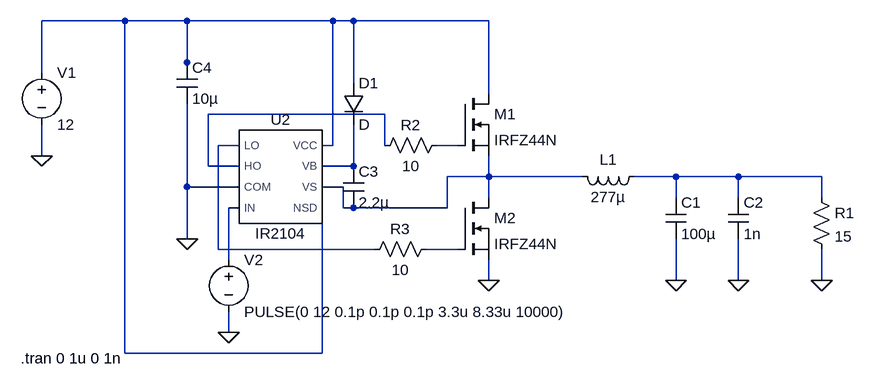
[diagram p0: schematic buck_driver.asc]
buck_driver.asc, the LTspice schematic file:
Version 4.1
SHEET 1 880 680
WIRE -480 -80 -608 -80
WIRE -384 -80 -480 -80
WIRE -160 -80 -384 -80
WIRE -128 -80 -160 -80
WIRE 80 -80 -128 -80
WIRE -384 -16 -384 -80
WIRE -608 0 -608 -80
WIRE -384 0 -384 -16
WIRE -128 16 -128 -80
WIRE 80 32 80 -80
WIRE -80 64 -352 64
WIRE -304 112 -336 112
WIRE -160 112 -160 -80
WIRE -160 112 -176 112
WIRE -80 112 -80 64
WIRE 32 112 0 112
WIRE -608 128 -608 80
WIRE -352 144 -352 64
WIRE -304 144 -352 144
WIRE -128 144 -128 80
WIRE -128 144 -176 144
WIRE 80 160 80 128
WIRE 80 160 16 160
WIRE 224 160 80 160
WIRE 368 160 304 160
WIRE 464 160 368 160
WIRE 592 160 464 160
WIRE -384 176 -384 48
WIRE -304 176 -384 176
WIRE -144 176 -176 176
WIRE 80 192 80 160
WIRE 368 192 368 160
WIRE 464 192 464 160
WIRE 592 192 592 160
WIRE -304 208 -320 208
WIRE -144 208 -144 176
WIRE -128 208 -144 208
WIRE 16 208 16 160
WIRE 16 208 -128 208
WIRE -384 256 -384 176
WIRE -336 272 -336 112
WIRE -96 272 -336 272
WIRE 32 272 -16 272
WIRE -320 288 -320 208
WIRE 80 320 80 288
WIRE 368 320 368 256
WIRE 464 320 464 256
WIRE 592 320 592 272
WIRE -320 400 -320 368
WIRE -480 432 -480 -80
WIRE -176 432 -176 208
WIRE -176 432 -480 432
FLAG 80 320 0
FLAG 368 320 0
FLAG 464 320 0
FLAG 592 320 0
FLAG -608 128 0
FLAG -384 256 0
FLAG -320 400 0
SYMBOL nmos 32 32 R0
SYMATTR InstName M1
SYMATTR Value IRFZ44N
SYMBOL ind 320 144 R90
WINDOW 0 5 56 VBottom 2
WINDOW 3 32 56 VTop 2
SYMATTR InstName L1
SYMATTR Value 277µ
SYMBOL nmos 32 192 R0
SYMATTR InstName M2
SYMATTR Value IRFZ44N
SYMBOL cap 352 192 R0
SYMATTR InstName C1
SYMATTR Value 100µ
SYMBOL cap 448 192 R0
SYMATTR InstName C2
SYMATTR Value 1n
SYMBOL res 576 176 R0
SYMATTR InstName R1
SYMATTR Value 15
SYMBOL voltage -608 -16 R0
WINDOW 123 0 0 Left 0
WINDOW 39 0 0 Left 0
SYMATTR InstName V1
SYMATTR Value 12
SYMBOL diode -144 16 R0
SYMATTR InstName D1
SYMBOL cap -144 144 R0
SYMATTR InstName C3
SYMATTR Value 2.2µ
SYMBOL res 16 96 R90
WINDOW 0 0 56 VBottom 2
WINDOW 3 32 56 VTop 2
SYMATTR InstName R2
SYMATTR Value 10
SYMBOL res 0 256 R90
WINDOW 0 0 56 VBottom 2
WINDOW 3 32 56 VTop 2
SYMATTR InstName R3
SYMATTR Value 10
SYMBOL cap -400 -16 R0
SYMATTR InstName C4
SYMATTR Value 10µ
SYMBOL voltage -320 272 R0
SYMATTR InstName V2
SYMATTR Value PULSE(0 12 0.1p 0.1p 0.1p 3.3u 8.33u 10000)
SYMBOL IR2104 -240 160 R0
SYMATTR InstName U2
TEXT -640 440 Left 2 !.tran 0 1u 0 1n

The netlist it stands for:
* buck_driver.asc
M1 N001 N004 N006 N006 IRFZ44N
L1 N007 N006 277µ
M2 N006 N009 0 0 IRFZ44N
C1 N007 0 100µ
C2 N007 0 1n
R1 N007 0 15
V1 N001 0 12
D1 N001 N005 D
C3 N005 N006 2.2µ
R2 N004 N002 10
R3 N009 N003 10
C4 N001 0 10µ
V2 N008 0 PULSE(0 12 0.1p 0.1p 0.1p 3.3u 8.33u 10000)
X§U2 N003 N002 0 N008 N001 N005 N006 N001 IR2104  ; pins LO HO COM IN VCC VB VS NSD
.model D D
.lib standard.dio
.model NMOS NMOS
.model PMOS PMOS
.lib standard.mos
.tran 0 1u 0 1n
.lib C:\Users\balta\OneDrive\Escritorio\PWM\IR2104.lib
.backanno
.end